# Altium project STM32F4.PrjPcb
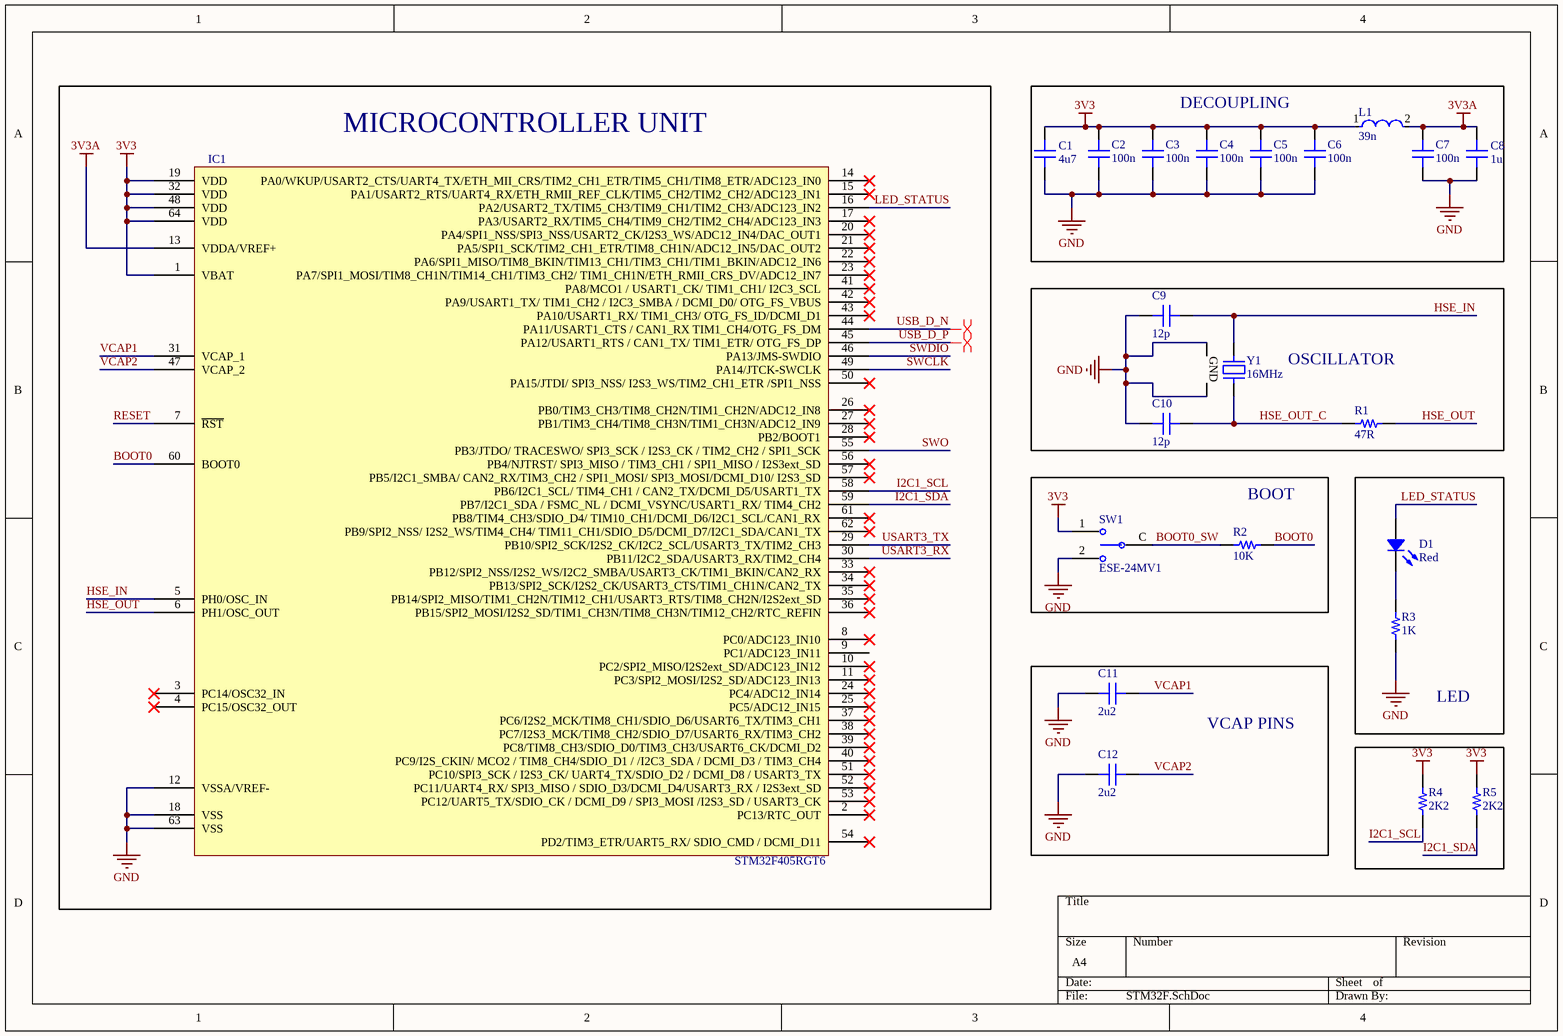
[diagram p0: STM32F.SchDoc]
2 sheets, 56 parts. Net scope: global (net labels, ports and power ports of the same name join across sheets).
Board file: STM32F4_PCB.PcbDoc
Sheets:
  STM32F.SchDoc
  PWR-CONNS.SchDoc

## Sheet STM32F.SchDoc
size A4; SheetNumber: 1; SheetTotal: 2

### Parts
C1  4u7  [CAP 0805_2012]
C2  100n  [CAP 0603_1608]
C3  100n  [CAP 0603_1608]
C4  100n  [CAP 0603_1608]
C5  100n  [CAP 0603_1608]
C6  100n  [CAP 0603_1608]
C7  100n  [CAP 0603_1608]
C8  1u  [CAP 0805_2012]
C9  12p  [CAP 0603_1608]
C10  12p  [CAP 0603_1608]
C11  2u2  [CAP 0603_1608]
C12  2u2  [CAP 0603_1608]
D1  Red  [LED 0603_1608 RED]
IC1  STM32F405RGT6  [ST LQFP-64 10X10MM]
L1  39n  [FP-LQW18AN_00-MFG]
R1  47R  [RES 0603_1608]
R2  10K  [RES 0603_1608]
R3  1K  [RES 0603_1608]
R4  2K2  [RES 0603_1608]
R5  2K2  [RES 0603_1608]
SW1  ESE-24MV1  [FP-ESE-24MV1-MFG]
Y1  16MHz  [ABRACON ABM10]

### Blocks framed on the sheet
MICROCONTROLLER UNIT: IC1
DECOUPLING: C1-C8 L1
OSCILLATOR: C9 C10 R1 Y1
BOOT: R2 SW1
LED: D1 R3
VCAP PINS: C11 C12

### Nets
3V3: C1.2 C2.2 C3.2 C4.2 C5.2 C6.2 IC1.1(VBAT) IC1.19(VDD) IC1.32(VDD) IC1.48(VDD) IC1.64(VDD) L1.1 R4.2 R5.2 SW1.1
3V3A: C7.2 C8.2 IC1.13(VDDA/VREF+) L1.2
GND: C1.1 C2.1 C3.1 C4.1 C5.1 C6.1 C7.1 C8.1 C9.2 C10.2 C11.2 C12.2 IC1.12(VSSA/VREF-) IC1.18(VSS) IC1.63(VSS) R3.1 SW1.2 Y1.2(GND) Y1.4(GND)
BOOT0: IC1.60(BOOT0) R2.2
BOOT0_SW: R2.1 SW1.C
HSE_IN: C9.1 IC1.5(PH0/OSC_IN) Y1.1
HSE_OUT: IC1.6(PH1/OSC_OUT) R1.2
HSE_OUT_C: C10.1 R1.1 Y1.3
I2C1_SCL: IC1.58(PB6/I2C1_SCL/_TIM4_CH1_/_CAN2_TX/DCMI_D5/USART1_TX) R4.1
I2C1_SDA: IC1.59(PB7/I2C1_SDA_/_FSMC_NL_/_DCMI_VSYNC/USART1_RX/_TIM4_CH2) R5.1
LED_STATUS: D1.1 IC1.16(PA2/USART2_TX/TIM5_CH3/TIM9_CH1/TIM2_CH3/ADC123_IN2)
RESET: IC1.7(~{RST})
SWCLK: IC1.49(PA14/JTCK-SWCLK)
SWDIO: IC1.46(PA13/JMS-SWDIO)
SWO: IC1.55(PB3/JTDO/_TRACESWO/_SPI3_SCK_/_I2S3_CK_/_TIM2_CH2_/_SPI1_SCK)
USART3_RX: IC1.30(PB11/I2C2_SDA/USART3_RX/TIM2_CH4)
USART3_TX: IC1.29(PB10/SPI2_SCK/I2S2_CK/I2C2_SCL/USART3_TX/TIM2_CH3)
USB_D_N: IC1.44(PA11/USART1_CTS_/_CAN1_RX_TIM1_CH4/OTG_FS_DM)
USB_D_P: IC1.45(PA12/USART1_RTS_/_CAN1_TX/_TIM1_ETR/_OTG_FS_DP)
VCAP1: C11.1 IC1.31(VCAP_1)
VCAP2: C12.1 IC1.47(VCAP_2)
NetD1_2: D1.2 R3.2

Not connected (* = marked no-connect by the designer): IC1 2(PC13/RTC_OUT)* 3(PC14/OSC32_IN)* 4(PC15/OSC32_OUT)* 8(PC0/ADC123_IN10)* 9(PC1/ADC123_IN11) 10(PC2/SPI2_MISO/I2S2ext_SD/ADC123_IN12)* 11(PC3/SPI2_MOSI/I2S2_SD/ADC123_IN13)* 14(PA0/WKUP/USART2_CTS/UART4_TX/ETH_MII_CRS/TIM2_CH1_ETR/TIM5_CH1/TIM8_ETR/ADC123_IN0)* 15(PA1/USART2_RTS/UART4_RX/ETH_RMII_REF_CLK/TIM5_CH2/TIM2_CH2/ADC123_IN1)* 17(PA3/USART2_RX/TIM5_CH4/TIM9_CH2/TIM2_CH4/ADC123_IN3)* 20(PA4/SPI1_NSS/SPI3_NSS/USART2_CK/I2S3_WS/ADC12_IN4/DAC_OUT1)* 21(PA5/SPI1_SCK/TIM2_CH1_ETR/TIM8_CH1N/ADC12_IN5/DAC_OUT2)* 22(PA6/SPI1_MISO/TIM8_BKIN/TIM13_CH1/TIM3_CH1/TIM1_BKIN/ADC12_IN6)* 23(PA7/SPI1_MOSI/TIM8_CH1N/TIM14_CH1/TIM3_CH2/_TIM1_CH1N/ETH_RMII_CRS_DV/ADC12_IN7)* 24(PC4/ADC12_IN14)* 25(PC5/ADC12_IN15)* 26(PB0/TIM3_CH3/TIM8_CH2N/TIM1_CH2N/ADC12_IN8)* 27(PB1/TIM3_CH4/TIM8_CH3N/TIM1_CH3N/ADC12_IN9)* 28(PB2/BOOT1)* 33(PB12/SPI2_NSS/I2S2_WS/I2C2_SMBA/USART3_CK/TIM1_BKIN/CAN2_RX)* 34(PB13/SPI2_SCK/I2S2_CK/USART3_CTS/TIM1_CH1N/CAN2_TX)* 35(PB14/SPI2_MISO/TIM1_CH2N/TIM12_CH1/USART3_RTS/TIM8_CH2N/I2S2ext_SD)* 36(PB15/SPI2_MOSI/I2S2_SD/TIM1_CH3N/TIM8_CH3N/TIM12_CH2/RTC_REFIN)* 37(PC6/I2S2_MCK/TIM8_CH1/SDIO_D6/USART6_TX/TIM3_CH1)* 38(PC7/I2S3_MCK/TIM8_CH2/SDIO_D7/USART6_RX/TIM3_CH2)* 39(PC8/TIM8_CH3/SDIO_D0/TIM3_CH3/USART6_CK/DCMI_D2)* 40(PC9/I2S_CKIN/_MCO2_/_TIM8_CH4/SDIO_D1_/_/I2C3_SDA_/_DCMI_D3_/_TIM3_CH4)* 41(PA8/MCO1_/_USART1_CK/_TIM1_CH1/_I2C3_SCL)* 42(PA9/USART1_TX/_TIM1_CH2_/_I2C3_SMBA_/_DCMI_D0/_OTG_FS_VBUS)* 43(PA10/USART1_RX/_TIM1_CH3/_OTG_FS_ID/DCMI_D1)* 50(PA15/JTDI/_SPI3_NSS/_I2S3_WS/TIM2_CH1_ETR_/SPI1_NSS)* 51(PC10/SPI3_SCK_/_I2S3_CK/_UART4_TX/SDIO_D2_/_DCMI_D8_/_USART3_TX)* 52(PC11/UART4_RX/_SPI3_MISO_/_SDIO_D3/DCMI_D4/USART3_RX_/_I2S3ext_SD)* 53(PC12/UART5_TX/SDIO_CK_/_DCMI_D9_/_SPI3_MOSI_/I2S3_SD_/_USART3_CK)* 54(PD2/TIM3_ETR/UART5_RX/_SDIO_CMD_/_DCMI_D11)* 56(PB4/NJTRST/_SPI3_MISO_/_TIM3_CH1_/_SPI1_MISO_/_I2S3ext_SD)* 57(PB5/I2C1_SMBA/_CAN2_RX/TIM3_CH2_/_SPI1_MOSI/_SPI3_MOSI/DCMI_D10/_I2S3_SD)* 61(PB8/TIM4_CH3/SDIO_D4/_TIM10_CH1/DCMI_D6/I2C1_SCL/CAN1_RX)* 62(PB9/SPI2_NSS/_I2S2_WS/TIM4_CH4/_TIM11_CH1/SDIO_D5/DCMI_D7/I2C1_SDA/CAN1_TX)*

### Layout directives
differential pair: USB_D_N, USB_D_P

### Library data of the parts
C1 C8 = C0805C222K4RAC7800: CAP CER 2200PF 16V X7R 0805; manufacturer: KEMET; Tolerance: ±10%; Part Number: C0805C222K4RAC7800; Applications: Bypass, Decoupling; Capacitance: 2200 pF; componentlink1description: Datasheet; componentlink1url: https://api.kemet.com/component-edge/download/datasheet/C0805C222K4RACTU.pdf; componentlink2description: DigiKey Link; componentlink2url: https://www.digikey.com/en/products/detail/kemet/C0805C222K4RAC7800/2212264; Device Package: 0805 (2012 Metric); lastupdated: 2/9/2024 8:15:14 PM; Lifecycle Status: Active; Minimum Order: 1; Mounting Type: Surface Mount, MLCC; Operating Temperature: -55°C ~ 125°C; Package / Case: 0805 (2012 Metric); packaging: TapeAndReel; partid: 40064; Part Status: Active; price: 0.04; series: SMD Comm X7R; Size / Dimension: 0.079" L x 0.049" W (2.00mm x 1.25mm); Supplier 1: DigiKey; Supplier Part Number 1: 399-C0805C222K4RAC7800CT-ND; Temperature Coefficient: X7R; Thickness (Max): 0.035" (0.88mm); Voltage - Rated: 16V
C2-C7 C9-C12 = C0603C104J4RAC7013: CAP CER SMD 0603 .1UF 5% X7R 16V; manufacturer: KEMET; Capacitance: 0.1 µF; Part Number: C0603C104J4RAC7013; Applications: Bypass, Decoupling; componentlink1description: Datasheet; componentlink1url: https://api.kemet.com/component-edge/download/datasheet/C0603C104J4RAC7013.pdf; componentlink2description: DigiKey Link; componentlink2url: https://www.digikey.com/en/products/detail/kemet/C0603C104J4RAC7013/8572406; Device Package: 0603 (1608 Metric); lastupdated: 2/9/2024 8:10:13 PM; Lifecycle Status: Active; Minimum Order: 1; Mounting Type: Surface Mount, MLCC; Operating Temperature: -55°C ~ 125°C; Package / Case: 0603 (1608 Metric); packaging: TapeAndReel; partid: 40484; Part Status: Active; price: 0.02; series: SMD Comm X7R; Size / Dimension: 0.063" L x 0.031" W (1.60mm x 0.80mm); Supplier 1: DigiKey; Supplier Part Number 1: 399-17571-1-ND; Temperature Coefficient: X7R; Thickness (Max): 0.037" (0.95mm); Tolerance: ±5%; Voltage - Rated: 16V
  C2-C7: Value: 100n
  C9 C10: Value: 12p
  C11 C12: Value: 2u2
D1 = APT1608SEC/J3-AMT: LED RED 0603; Manufacturer: Kingbright; Current - Test: 20mA; Lens Color: Colorless; Lens Size: 1.60mm x 0.80mm; Lens Style: Rectangle with Flat Top; Lens Transparency: Clear; Millicandela Rating: 900mcd; Viewing Angle: 120°; Voltage - Forward (Vf) (Typ): 2.2V; Wavelength - Dominant: 623nm; Wavelength - Peak: 640nm; Part Number: APT1608SEC/J3-AMT; Color: Red; ComponentLink1Description: Datasheet; ComponentLink1URL: https://www.kingbrightusa.com/images/catalog/SPEC/APT1608SEC-J3-AMT.pdf; ComponentLink2Description: DigiKey Link; ComponentLink2URL: https://www.digikey.com/en/products/detail/kingbright/APT1608SEC-J3-AMT/17969025; Device Package: 0603 (1608 Metric); Height (Max): 0.85mm; LastUpdated: 2/8/2024 9:32:15 PM; Lifecycle Status: Active; Minimum Order: 1; Mounting Type: Surface Mount; Package / Case: 0603 (1608 Metric); Packaging: TapeAndReel; PartId: 1301; Part Status: Active; Price: 0.23; Series: High Temp; Size / Dimension: 1.60mm L x 0.85mm W; Supplier 1: DigiKey; Supplier Part Number 1: 754-APT1608SEC/J3-AMTCT-ND; Supplier Device Package: 0603; Value: Red
IC1 = STM32F405RGT6: IC MCU 32BIT 1MB FLASH 64LQFP; Manufacturer: STMicroelectronics; Connectivity: CANbus, I²C, IrDA, LINbus, SPI, UART/USART, USB OTG; Core Processor: ARM® Cortex®-M4; Core Size: 32-Bit; Data Converters: A/D 16x12b; D/A 2x12b; Number of I/O: 51; Oscillator Type: Internal; Peripherals: Brown-out Detect/Reset, DMA, I²S, LCD, POR, PWM, WDT; Program Memory Size: 1MB (1M x 8); RAM Size: 192K x 8; Speed: 168MHz; Voltage - Supply (Vcc/Vdd): 1.8V ~ 3.6V; Part Number: STM32F405RGT6; ComponentLink1Description: Datasheet; ComponentLink1URL: http://www.st.com/content/ccc/resource/technical/document/datasheet/ef/92/76/6d/bb/c2/4f/f7/DM00037051.pdf/files/DM00037051.pdf/jcr:content/translations/en.DM00037051.pdf; ComponentLink2Description: DigiKey Link; ComponentLink2URL: //digikey.com/product-detail/en/stmicroelectronics/STM32F405RGT6/497-11767-ND/2754208; Device Package: 64-LQFP; LastUpdated: 12/5/2019 11:44:20 PM; Lifecycle Status: 0; Minimum Order: 1; Mounting Type: Surface Mount; Operating Temperature: -40°C ~ 85°C (TA); Package / Case: 64-LQFP; Packaging: Tray; PartId: 115; Part Status: Active; Price: 10.30; Program Memory Type: FLASH; Series: STM32F4; Supplier 1: DigiKey; Supplier Part Number 1: 497-11767-ND; Supplier Device Package: 64-LQFP (10x10)
L1 = CMP-06042-008736-1: Wire Wound RF Inductor 39nH ±2% 400mA 0.26Ω 0603 (1608); Core Material: Non-Magnetic; Test Frequency: 100MHz; Shielding: Unshielded; Q Factor: 40; Self Resonant Frequency: 2.8GHz; Current: 370mA; DC Resistance (DCR): 260mR; Package Quantity: 4000; Case/Package: 0603; Resistor Type: Wirewound; Height - Seated (Max): 0.039inch; Lead Free: Lead Free; Min Operating Temperature: -55°C; Case Code (Imperial): 0603; Radiation Hardening: No; Max Operating Temperature: 125°C; Military Standard: Not; Depth: 1mm; Height: 0.8mm; Inductance: 39nH; Case Code (Metric): 1608; Termination: SMD/SMT; Current Rating: 400mA; Max DC Current: 400mA; Tolerance: 2%; Width: 0.031inch; Series Resistance: 260mR; Weight: 0.000106oz; DC Current: 400mA; Length: 1.6mm; Packaging: Tape and Reel; Mount: Surface Mount
R1-R5 = AC0603FR-0747RL: RES SMD 47 OHM 1% 1/10W 0603; Manufacturer: Yageo; Power (Watts): 0.1W, 1/10W; Resistance: 47 Ohms; Temperature Coefficient: ±100ppm/°C; Part Number: AC0603FR-0747RL; ComponentLink1Description: Datasheet; ComponentLink1URL: https://www.yageo.com/upload/media/product/productsearch/datasheet/rchip/PYu-AC_51_RoHS_L_7.pdf; ComponentLink2Description: DigiKey Link; ComponentLink2URL: https://www.digikey.com/en/products/detail/yageo/AC0603FR-0747RL/2827825; Composition: Thick Film; Device Package: 0603 (1608 Metric); Features: Automotive AEC-Q200, Moisture Resistant; Height - Seated (Max): 0.022" (0.55mm); LastUpdated: 2/9/2024 8:42:47 PM; Lifecycle Status: Active; Minimum Order: 1; Number of Terminations: 2; Operating Temperature: -55°C ~ 155°C; Package / Case: 0603 (1608 Metric); Packaging: CutTape; PartId: 17426; Part Status: Active; Price: 0.01; Ratings: AEC-Q200; Series: AC; Size / Dimension: 0.063" L x 0.031" W (1.60mm x 0.80mm); Supplier 1: DigiKey; Supplier Part Number 1: 311-47LDCT-ND; Supplier Device Package: 0603; Tolerance: ±1%
  R1: Value: 47R
  R2: Value: 10K
  R3: Value: 1K
  R4 R5: Value: 2K2
SW1 = CMP-05617-000023-1: SWITCH DETECTOR SPDT 10MA 5V; Operating Force: 0.35N; Actuator Type: Toggle; Operating Position: 0.317inch; Mechanical Life: 50000Cycles; Contact Resistance: 500mR; Body Depth: 3mm; Actuator Length: 2.95mm; Switch Function: Mom-Off-Mom; Body Length: 7.5mm; Body Height: 5.6mm; Number of Terminals/Pins: 3; Case/Package: SMD/SMT; Throw Configuration: SPDT; RoHS Compliant: Yes; Current Rating: 10mA; Mount: Surface Mount; Number of Pins: 3; Termination: SMD/SMT; Packaging: Bulk; Max Voltage Rating (DC): 5V; REACH SVHC: No SVHC; Width: 3mm; Orientation: Straight; Series: ESE24; Height: 5.6mm; Lead Free: Lead Free; Voltage Rating (DC): 5V; Package Quantity: 1000; Min Operating Temperature: -10°C; Electrical Life: 50000Cycles; Max Operating Temperature: 70°C
Y1 = ABM10-16.000MHZ-E20-T: CRYSTAL 16.0000MHZ 10PF SMD; Manufacturer: Abracon LLC; ESR (Equivalent Series Resistance): 150 Ohms; Frequency Stability: ±20ppm; Operating Mode: Fundamental; Part Number: ABM10-16.000MHZ-E20-T; ComponentLink1Description: Datasheet; ComponentLink1URL: https://abracon.com/Resonators/ABM10.pdf; ComponentLink2Description: DigiKey Link; ComponentLink2URL: http://digikey.com/product-detail/en/abracon-llc/ABM10-16.000MHZ-E20-T/535-9810-1-ND/2001433; Device Package: 4-SMD, No Lead; Frequency: 16MHz; Frequency Tolerance: ±20ppm; Height - Seated (Max): 0.028" (0.70mm); LastUpdated: 3/19/2020 10:27:46 PM; Lifecycle Status: Active; Load Capacitance: 10pF; Minimum Order: 1; Mounting Type: Surface Mount; Operating Temperature: -20°C ~ 70°C; Package / Case: 4-SMD, No Lead; Packaging: TapeAndReel; PartId: 278; Part Status: Active; Price: 0.96; Series: ABM10; Size / Dimension: 0.098" L x 0.079" W (2.50mm x 2.00mm); Supplier 1: DigiKey; Supplier Part Number 1: 535-9810-1-ND; Type: MHz Crystal; Value: 16MHz

## Sheet PWR-CONNS.SchDoc
size A; SheetNumber: 2; SheetTotal: 2
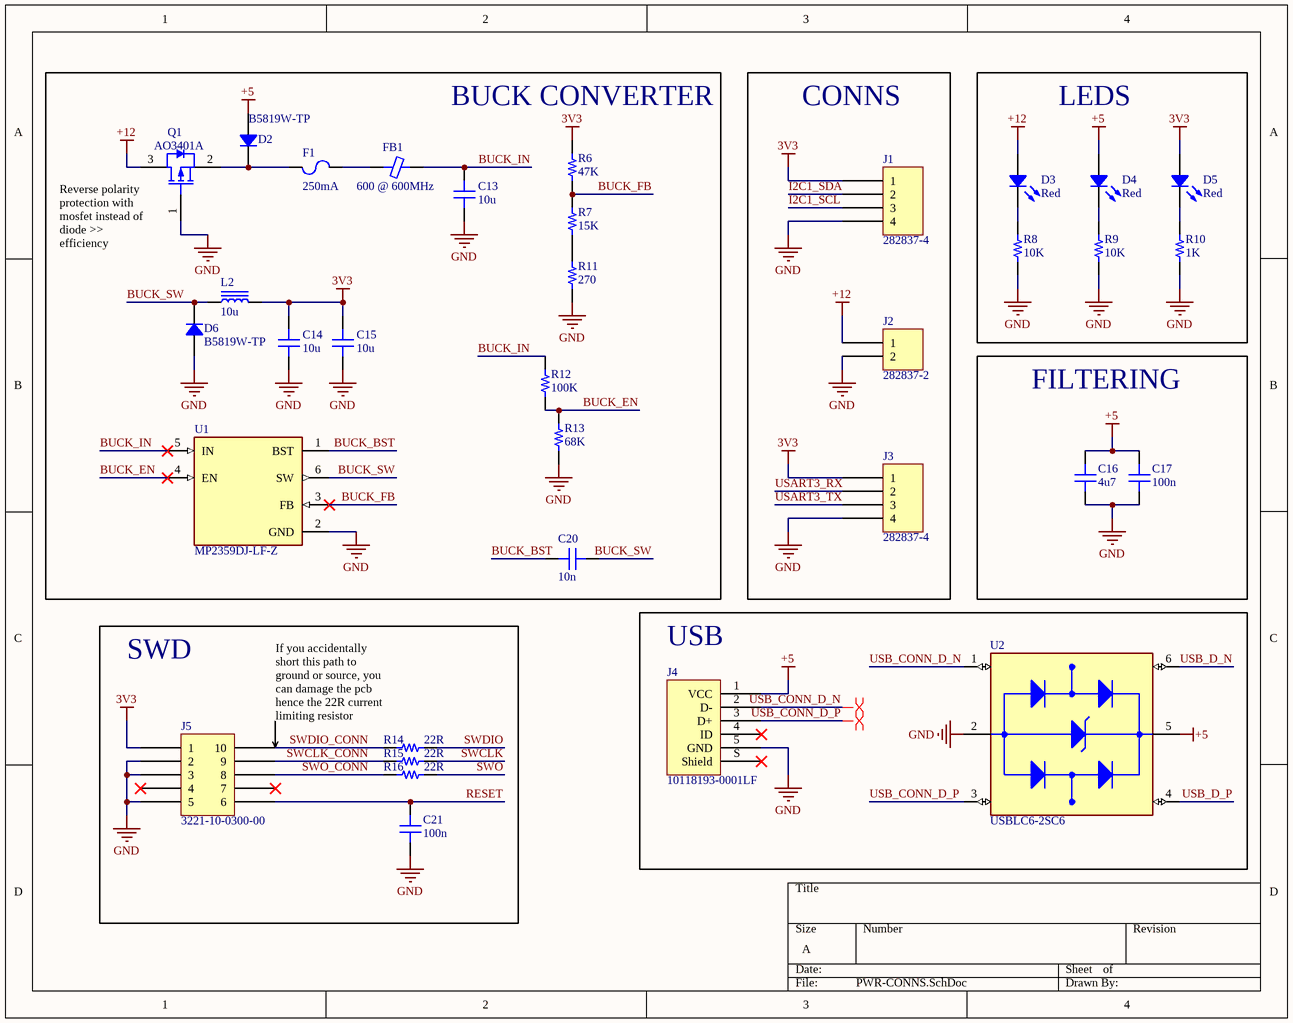
[diagram p1: PWR-CONNS.SchDoc]

### Parts
C13  10u  [CAP 0805_2012]
C14  10u  [CAP 0805_2012]
C15  10u  [CAP 0805_2012]
C16  4u7  [CAP 0603_1608]
C17  100n  [CAP 0603_1608]
C20  10n  [CAP 0805_2012]
C21  100n  [CAP 0603_1608]
D2  B5819W-TP  [SOD-123]
D3  Red  [LED 0603_1608 RED]
D4  Red  [LED 0603_1608 RED]
D5  Red  [LED 0603_1608 RED]
D6  B5819W-TP  [SOD-123]
F1  250mA  [FUSE 1206_3216 0.6MM]
FB1  600 @ 600MHz  [FER 0402_1005]
J1  282837-4  [TE 282837-4]
J2  282837-2  [TE 282837-2]
J3  282837-4  [TE 282837-4]
J4  10118193-0001LF  [FCI USB 10118193-0001LF]
J5  3221-10-0300-00  [CNC TECH 3221-10-0300-00]
L2  10u  [BOURNS SRP5030T]
Q1  AO3401A  [AO-SOT-23-3L_V]
R6  47K  [RES 0603_1608]
R7  15K  [RES 0603_1608]
R8  10K  [RES 0603_1608]
R9  10K  [RES 0603_1608]
R10  1K  [RES 0603_1608]
R11  270  [RES 0603_1608]
R12  100K  [RES 0603_1608]
R13  68K  [RES 0603_1608]
R14  22R  [RES 0603_1608]
R15  22R  [RES 0603_1608]
R16  22R  [RES 0603_1608]
U1  MP2359DJ-LF-Z  [SOT95P280X100-6N]
U2  USBLC6-2SC6  [SOT95P280X145-6N]

### Blocks framed on the sheet
CONNS: J1-J3
LEDS: D3-D5 R8-R10
FILTERING: C16 C17
USB: J4 U2
SWD: C21 J5 R14-R16

### Nets
3V3: C14.2 C15.2 D5.1 J1.1 J3.1 J5.1 L2.2 R6.2
+5: C16.1 C17.1 D2.1 D4.1 J4.1(VCC) U2.5(VBUS)
+12: D3.1 J2.1 Q1.3(DRAIN)
GND: C13.1 C14.1 C15.1 C16.2 C17.2 C21.2 D6.1 J1.4 J2.2 J3.4 J4.5(GND) J5.2 J5.3 J5.5 Q1.1(GATE) R8.1 R9.1 R10.1 R11.1 R13.1 U1.2(GND) U2.2(GND)
BUCK_BST: C20.2 U1.1(BST)
BUCK_EN: R12.1 R13.2 U1.4(EN)
BUCK_FB: R6.1 R7.2 U1.3(FB)
BUCK_IN: C13.2 FB1.2 R12.2 U1.5(IN)
BUCK_SW: C20.1 D6.2 L2.1 U1.6(SW)
I2C1_SCL: J1.3
I2C1_SDA: J1.2
RESET: C21.1 J5.6
SWCLK: R15.1
SWCLK_CONN: J5.9 R15.2
SWDIO: R14.1
SWDIO_CONN: J5.10 R14.2
SWO: R16.1
SWO_CONN: J5.8 R16.2
USART3_RX: J3.2
USART3_TX: J3.3
USB_CONN_D_N: J4.2(D-) U2.1(I/O1_IN)
USB_CONN_D_P: J4.3(D+) U2.3(I/O2_IN)
USB_D_N: U2.6(I/O1_OUT)
USB_D_P: U2.4(I/O2_OUT)
NetD2_2: D2.2 F1.1 Q1.2(SOURCE)
NetD3_2: D3.2 R8.2
NetD4_2: D4.2 R9.2
NetD5_2: D5.2 R10.2
NetF1_2: F1.2 FB1.1
NetR7_1: R7.1 R11.2

Not connected (* = marked no-connect by the designer): J4 4(ID)* S(Shield)*; J5 4* 7*

### Layout directives
differential pair: USB_CONN_D_N, USB_CONN_D_P

### Notes on the sheet
- (near R6) BUCK CONVERTER
- (near Q1) Reverse polarity protection with mosfet instead of diode >> efficiency
- If you accidentally short this path to ground or source, you can damage the pcb hence the 22R current limiting resistor
- Type @ to refer to a designator or a net

### Library data of the parts
C13-C15 C20 = C0805C222K4RAC7800: as C1 on sheet STM32F; Part Number: C0805C222K4RAC7800; Applications: Bypass, Decoupling; Capacitance: 2200 pF; componentlink1description: Datasheet; componentlink1url: https://api.kemet.com/component-edge/download/datasheet/C0805C222K4RACTU.pdf; componentlink2description: DigiKey Link; componentlink2url: https://www.digikey.com/en/products/detail/kemet/C0805C222K4RAC7800/2212264; Device Package: 0805 (2012 Metric); lastupdated: 2/9/2024 8:15:14 PM; Lifecycle Status: Active; Minimum Order: 1; Mounting Type: Surface Mount, MLCC; Operating Temperature: -55°C ~ 125°C; Package / Case: 0805 (2012 Metric); packaging: TapeAndReel; partid: 40064; Part Status: Active; price: 0.04; series: SMD Comm X7R; Size / Dimension: 0.079" L x 0.049" W (2.00mm x 1.25mm); Supplier 1: DigiKey; Supplier Part Number 1: 399-C0805C222K4RAC7800CT-ND; Temperature Coefficient: X7R; Thickness (Max): 0.035" (0.88mm); Voltage - Rated: 16V
C16 C17 C21 = C0603C104J4RAC7013: as C2 on sheet STM32F; Part Number: C0603C104J4RAC7013; Applications: Bypass, Decoupling; componentlink1description: Datasheet; componentlink1url: https://api.kemet.com/component-edge/download/datasheet/C0603C104J4RAC7013.pdf; componentlink2description: DigiKey Link; componentlink2url: https://www.digikey.com/en/products/detail/kemet/C0603C104J4RAC7013/8572406; Device Package: 0603 (1608 Metric); lastupdated: 2/9/2024 8:10:13 PM; Lifecycle Status: Active; Minimum Order: 1; Mounting Type: Surface Mount, MLCC; Operating Temperature: -55°C ~ 125°C; Package / Case: 0603 (1608 Metric); packaging: TapeAndReel; partid: 40484; Part Status: Active; price: 0.02; series: SMD Comm X7R; Size / Dimension: 0.063" L x 0.031" W (1.60mm x 0.80mm); Supplier 1: DigiKey; Supplier Part Number 1: 399-17571-1-ND; Temperature Coefficient: X7R; Thickness (Max): 0.037" (0.95mm); Tolerance: ±5%; Voltage - Rated: 16V
  C16: Value: 4u7
  C17 C21: Value: 100n
D2 D6 = B5819W-TP: DIODE SCHOTTKY 40V 1A SOD123; Manufacturer: Micro Commercial Co; Capacitance @ Vr, F: 120pF @ 4V, 1MHz; Current - Reverse Leakage @ Vr: 1 mA @ 40 V; Speed: Fast Recovery =< 500ns, > 200mA (Io); Voltage - Forward (Vf) (Max) @ If: 600 mV @ 1 A; Part Number: B5819W-TP; ComponentLink1Description: Datasheet; ComponentLink1URL: https://www.mccsemi.com/pdf/Products/B5817W-B5819W(SOD-123).pdf; ComponentLink2Description: DigiKey Link; ComponentLink2URL: https://www.digikey.com/en/products/detail/micro-commercial-co/B5819W-TP/3774959; Current - Average Rectified (Io): 1A; Diode Type: Schottky; LastUpdated: 2/8/2024 9:27:27 PM; Lifecycle Status: Active; Minimum Order: 1; Mounting Type: Surface Mount; Operating Temperature - Junction: -65°C ~ 125°C; Package / Case: SOD-123; Packaging: TapeAndReel; PartId: 2331; Part Status: Active; Price: 0.03; Series: -; Supplier 1: DigiKey; Supplier Part Number 1: B5819W-TPMSCT-ND; Supplier Device Package: SOD-123; Voltage - DC Reverse (Vr) (Max): 40 V
D3-D5 = APT1608SEC/J3-AMT: as D1 on sheet STM32F; Part Number: APT1608SEC/J3-AMT; Color: Red; ComponentLink1Description: Datasheet; ComponentLink1URL: https://www.kingbrightusa.com/images/catalog/SPEC/APT1608SEC-J3-AMT.pdf; ComponentLink2Description: DigiKey Link; ComponentLink2URL: https://www.digikey.com/en/products/detail/kingbright/APT1608SEC-J3-AMT/17969025; Device Package: 0603 (1608 Metric); Height (Max): 0.85mm; LastUpdated: 2/8/2024 9:32:15 PM; Lifecycle Status: Active; Minimum Order: 1; Mounting Type: Surface Mount; Package / Case: 0603 (1608 Metric); Packaging: TapeAndReel; PartId: 1301; Part Status: Active; Price: 0.23; Series: High Temp; Size / Dimension: 1.60mm L x 0.85mm W; Supplier 1: DigiKey; Supplier Part Number 1: 754-APT1608SEC/J3-AMTCT-ND; Supplier Device Package: 0603; Value: Red
F1 = SF-1206FP050-2: FUSE BOARD MNT 500MA 63VDC 1206; Manufacturer: Bourns Inc.; Approval Agency: UL; Breaking Capacity @ Rated Voltage: 50A; Fuse Type: Board Mount (Cartridge Style Excluded); Melting I²t: 0.015; Response Time: Fast Blow; Voltage Rating - DC: 63V; Part Number: SF-1206FP050-2; Approvals: UL; ComponentLink1Description: Datasheet; ComponentLink1URL: https://www.bourns.com/docs/product-datasheets/sf-1206fp.pdf; ComponentLink2Description: DigiKey Link; ComponentLink2URL: http://digikey.com/product-detail/en/bourns-inc/SF-1206FP050-2/SF-1206FP050-2CT-ND/7652265; Current Rating (Amps): 500mA; Device Package: 1206 (3216 Metric); LastUpdated: 9/2/2020 1:30:42 AM; Lifecycle Status: Active; Minimum Order: 1; Mounting Type: Surface Mount; Operating Temperature: -20°C ~ 105°C; Package / Case: 1206 (3216 Metric); Packaging: TapeAndReel; Part Status: Active; Price: 0.34; Series: SinglFuse™ SF-1206FP; Size / Dimension: 0.122" L x 0.061" W x 0.024" H (3.10mm x 1.55mm x 0.60mm); Supplier 1: DigiKey; Supplier Part Number 1: SF-1206FP050-2CT-ND
FB1 = Z0402C601ESMST: FERRITE BEAD 600 OHM 0402 1LN; Manufacturer: KEMET; Current Rating (Max): 300mA; DC Resistance (DCR) (Max): 600mOhm; Filter Type: Signal Line; Impedance @ Frequency: 600 Ohms @ 100MHz; Number of Lines: 1; Value: 600 Ohms @ 100MHz; Part Number: Z0402C601ESMST; ComponentLink1Description: Datasheet; ComponentLink1URL: https://content.kemet.com/datasheets/F3115.pdf; ComponentLink2Description: DigiKey Link; ComponentLink2URL: http://digikey.com/product-detail/en/kemet/Z0402C601ESMST/399-9606-1-ND/3674215; Device Package: 0402 (1005 Metric); Height (Max): 0.022" (0.55mm); LastUpdated: 2/8/2024 9:23:50 PM; Lifecycle Status: Active; Minimum Order: 1; Mounting Type: Surface Mount; Operating Temperature: -55°C ~ 125°C; Package / Case: 0402 (1005 Metric); Packaging: TapeAndReel; PartId: 516; Part Status: Active; Price: 0.03; Series: Z-SMS; Size / Dimension: 0.039" L x 0.020" W (1.00mm x 0.50mm); Supplier 1: DigiKey; Supplier Part Number 1: 399-9606-1-ND
J1 J3 = 282837-4: TERM BLK 4P SIDE ENT 5.08MM PCB; Manufacturer: TE Connectivity AMP Connectors; Current: 13.5 A; Mating Orientation: Horizontal with Board; Number of Levels: 1; Pitch: 0.200" (5.08mm); Positions Per Level: 4; Voltage: 300 V; Wire Gauge: 16-28 AWG; Wire Termination: Screw - Rising Cage Clamp; Part Number: 282837-4; Color: Green; ComponentLink1Description: Datasheet; ComponentLink1URL: https://www.te.com/commerce/DocumentDelivery/DDEController?Action=srchrtrv&DocNm=282837&DocType=Customer+Drawing&DocLang=English; ComponentLink2Description: DigiKey Link; ComponentLink2URL: https://www.digikey.com/en/products/detail/te-connectivity-amp-connectors/282837-4/2187975; Features: Interlocking (Side); LastUpdated: 6/21/2022 3:00:53 PM; Lifecycle Status: Active; Minimum Order: 1; Mounting Type: Through Hole; Packaging: Tray; Part Status: Active; Price: 0.62; Series: Buchanan; Supplier 1: DigiKey; Supplier Part Number 1: A124423-ND
J2 = 282837-2: TERM BLK 2P SIDE ENT 5.08MM PCB; Manufacturer: TE Connectivity AMP Connectors; Current: 13.5 A; Mating Orientation: Horizontal with Board; Number of Levels: 1; Pitch: 0.200" (5.08mm); Positions Per Level: 2; Voltage: 300 V; Wire Gauge: 16-28 AWG; Wire Termination: Screw - Rising Cage Clamp; Part Number: 282837-2; Color: Green; ComponentLink1Description: Datasheet; ComponentLink1URL: https://www.te.com/commerce/DocumentDelivery/DDEController?Action=srchrtrv&DocNm=282837&DocType=Customer+Drawing&DocLang=English; ComponentLink2Description: DigiKey Link; ComponentLink2URL: https://www.digikey.com/en/products/detail/te-connectivity-amp-connectors/282837-2/2187973; Features: Interlocking (Side); LastUpdated: 6/21/2022 3:00:23 PM; Lifecycle Status: Active; Minimum Order: 1; Mounting Type: Through Hole; Packaging: Tray; Part Status: Active; Price: 0.31; Series: Buchanan; Supplier 1: DigiKey; Supplier Part Number 1: A113320-ND
J4 = 10118193-0001LF: CONN RCPT USB2.0 MICRO B SMD R/A; Manufacturer: Amphenol ICC (FCI); Connector Type: USB - micro B; Current Rating (Amps): 1.8A per Contact; Gender: Receptacle; Mating Cycles: 10000; Number of Contacts: 5; Number of Ports: 1; Shielding: Shielded; Voltage - Rated: 100VAC; Part Number: 10118193-0001LF; ComponentLink1Description: Datasheet; ComponentLink1URL: https://cdn.amphenol-icc.com/media/wysiwyg/files/documentation/datasheet/inputoutput/io_usb_micro.pdf; ComponentLink2Description: DigiKey Link; ComponentLink2URL: //digikey.com/product-detail/en/amphenol-icc-fci/10118193-0001LF/609-4616-2-ND/2785388; Features: Solder Retention; LastUpdated: 12/9/2019 8:51:28 PM; Lifecycle Status: 0; Minimum Order: 1; Mounting Feature: Horizontal; Mounting Type: Surface Mount, Right Angle; Through Hole; Operating Temperature: -30°C ~ 80°C; Packaging: TapeAndReel; Part Status: Active; Price: 0.21; Series: -; Specifications: USB 2.0; Supplier 1: DigiKey; Supplier Part Number 1: 609-4616-2-ND; Termination: Solder
J5 = 3221-10-0300-00: CONN HEADER SMD 10POS 1.27MM; Manufacturer: CNC Tech; Current Rating (Amps): 1A; Material Flammability Rating: UL94 V-0; Number of Positions: 10; Number of Positions Loaded: All; Pitch - Mating: 0.050" (1.27mm); Shrouding: Shrouded - 4 Wall; Style: Board to Cable/Wire; Part Number: 3221-10-0300-00; ComponentLink1Description: Datasheet; ComponentLink1URL: http://cnctech.us/idcmatching2.pdf; ComponentLink2Description: DigiKey Link; ComponentLink2URL: http://digikey.com/product-detail/en/cnc-tech/3221-10-0300-00/1175-1735-ND/4878946; Connector Type: Header; Contact Finish - Mating: Gold; Contact Finish - Post: Gold; Contact Finish Thickness - Mating: Flash; Contact Material: Brass; Contact Shape: Square; Contact Type: Male Pin; Fastening Type: Push-Pull; Features: Keying Slot; Insulation Height: 0.213" (5.40mm); Insulation Material: Polyamide (PA6T), Nylon 6T; LastUpdated: 1/13/2020 12:09:21 AM; Lifecycle Status: Active; Minimum Order: 1; Mounting Type: Surface Mount; Number of Rows: 2; Operating Temperature: -40°C ~ 105°C; Packaging: Tray; PartId: 109; Part Status: Active; Price: 0.73; Row Spacing - Mating: 0.050" (1.27mm); Series: -; Supplier 1: DigiKey; Supplier Part Number 1: 1175-1735-ND; Termination: Solder
L2 = SRP5030T-100M: FIXED IND 10UH 2.75A 128MOHM SMD; Manufacturer: Bourns Inc.; Current - Saturation: 3.5A; DC Resistance (DCR): 128mOhm Max; Inductance: 10 µH; Inductance Frequency - Test: 100 kHz; Material - Core: Iron Powder; Shielding: Shielded; Tolerance: ±20%; Type: Drum Core, Wirewound; Value: 10 µH; Part Number: SRP5030T-100M; ComponentLink1Description: Datasheet; ComponentLink1URL: https://www.bourns.com/docs/Product-Datasheets/SRP5030T.pdf; ComponentLink2Description: DigiKey Link; ComponentLink2URL: https://www.digikey.com/en/products/detail/bourns-inc/SRP5030T-100M/3986087; Current Rating (Amps): 2.75 A; Device Package: Nonstandard; Height - Seated (Max): 0.118" (3.00mm); LastUpdated: 2/8/2024 9:34:53 PM; Lifecycle Status: Active; Minimum Order: 1; Mounting Type: Surface Mount; Operating Temperature: -40°C ~ 125°C; Package / Case: Nonstandard; Packaging: TapeAndReel; PartId: 9; Part Status: Active; Price: 0.59; Series: SRP5030T; Size / Dimension: 0.224" L x 0.205" W (5.70mm x 5.20mm); Supplier 1: DigiKey; Supplier Part Number 1: SRP5030T-100MCT-ND
Q1 = CMP-2000-05778-1: P-Channel MOSFET, 30 V, 4 A, -55 to 150 degC, 3-Pin SOT-23-3L, RoHS, Tape and Reel; Manufacturer: Alpha and Omega; Output Power (Max): NotRequiredW; Power Dissipation: 1.4W; Rad Hardened: No; Drain Efficiency: NotRequired%; Drain-Source On-Volt: 30V; Noise Figure: NotRequireddB; Frequency (Max): NotRequiredMHz; Number of  Elements: 1; Gate-Source Voltage (Max): ?12V; Drain Current (Max): 4A; Channel Mode: Enhancement; Drain-Source On-Res: 0.044ohm; Type: PowerMOSFET; Polarity: P; Package URL: http://www.aosmd.com/res/packaging_information/SOT-23-3L.pdf; Datasheet URL: http://www.aosmd.com/res/data_sheets/AO3401A.pdf; Package Type: SOT-23; Package Description: 3-Pin Small Outline Transistor, Body 2.95 x 1.6 mm, Pitch 0.95 mm; Mounting: SurfaceMount; Manufacturer URL: http://www.aosmd.com/; Continuous Drain Current: 4A; Package Reference: SOT-23-3L; Mounting Technology: SurfaceMount; Operating Temperature Classification: Military; Power Gain: NotRequireddB; Datasheet Version: Rev. 3, 03/2011; Operating Temp Range: -55Cto150C; Pin Count: 3
R6-R16 = AC0603FR-0747RL: as R1 on sheet STM32F; Part Number: AC0603FR-0747RL; ComponentLink1Description: Datasheet; ComponentLink1URL: https://www.yageo.com/upload/media/product/productsearch/datasheet/rchip/PYu-AC_51_RoHS_L_7.pdf; ComponentLink2Description: DigiKey Link; ComponentLink2URL: https://www.digikey.com/en/products/detail/yageo/AC0603FR-0747RL/2827825; Composition: Thick Film; Device Package: 0603 (1608 Metric); Features: Automotive AEC-Q200, Moisture Resistant; Height - Seated (Max): 0.022" (0.55mm); LastUpdated: 2/9/2024 8:42:47 PM; Lifecycle Status: Active; Minimum Order: 1; Number of Terminations: 2; Operating Temperature: -55°C ~ 155°C; Package / Case: 0603 (1608 Metric); Packaging: CutTape; PartId: 17426; Part Status: Active; Price: 0.01; Ratings: AEC-Q200; Series: AC; Size / Dimension: 0.063" L x 0.031" W (1.60mm x 0.80mm); Supplier 1: DigiKey; Supplier Part Number 1: 311-47LDCT-ND; Supplier Device Package: 0603; Tolerance: ±1%
  R6: Value: 47K
  R7: Value: 15K
  R8 R9: Value: 10K
  R10: Value: 1K
  R11: Value: 270
  R12: Value: 100K
  R13: Value: 68K
  R14-R16: Value: 22R
U1 = MP2359DJ-LF-Z: Buck Switching Regulator IC Positive Adjustable 0.81V 1 Output 1.2A SOT-23-6 Thin, TSOT-23-6; MF: Monolithic Power; SnapEDA_Link: https://www.snapeda.com/parts/MP2359DJ-LF-Z/Monolithic+Power+Systems+Inc./view-part/?ref=snap; Package: TSOT-23-6 Monolithic Power Systems; Value: *; MP: MP2359DJ-LF-Z; Check_prices: https://www.snapeda.com/parts/MP2359DJ-LF-Z/Monolithic+Power+Systems+Inc./view-part/?ref=eda
U2 = USBLC6-2SC6: 17V Clamp 5A (8/20Âµs) Ipp Tvs Diode Surface Mount SOT-23-6; MF: STMicroelectronics; Value: *; SnapEDA_Link: https://www.snapeda.com/parts/USBLC6-2SC6/STMicroelectronics/view-part/?ref=snap; Check_prices: https://www.snapeda.com/parts/USBLC6-2SC6/STMicroelectronics/view-part/?ref=eda; Purchase-URL: https://pricing.snapeda.com/search/part/USBLC6-2SC6/?ref=eda; Price: None; Availability: In Stock; Package: SOT-23-6 STMicroelectronics; MP: USBLC6-2SC6

## Nets that join several sheets
3V3: STM32F (15 pins), PWR-CONNS (8 pins)
GND: STM32F (19 pins), PWR-CONNS (22 pins)
I2C1_SCL: STM32F (IC1.58 R4.1), PWR-CONNS (J1.3)
I2C1_SDA: STM32F (IC1.59 R5.1), PWR-CONNS (J1.2)
RESET: STM32F (IC1.7), PWR-CONNS (C21.1 J5.6)
SWCLK: STM32F (IC1.49), PWR-CONNS (R15.1)
SWDIO: STM32F (IC1.46), PWR-CONNS (R14.1)
SWO: STM32F (IC1.55), PWR-CONNS (R16.1)
USART3_RX: STM32F (IC1.30), PWR-CONNS (J3.2)
USART3_TX: STM32F (IC1.29), PWR-CONNS (J3.3)
USB_D_N: STM32F (IC1.44), PWR-CONNS (U2.6)
USB_D_P: STM32F (IC1.45), PWR-CONNS (U2.4)